# Altium schematic sheet ESP32 Schematic Sheet.SchDoc (part 1 of 3)
size A2; SheetNumber: 1; SheetTotal: 1
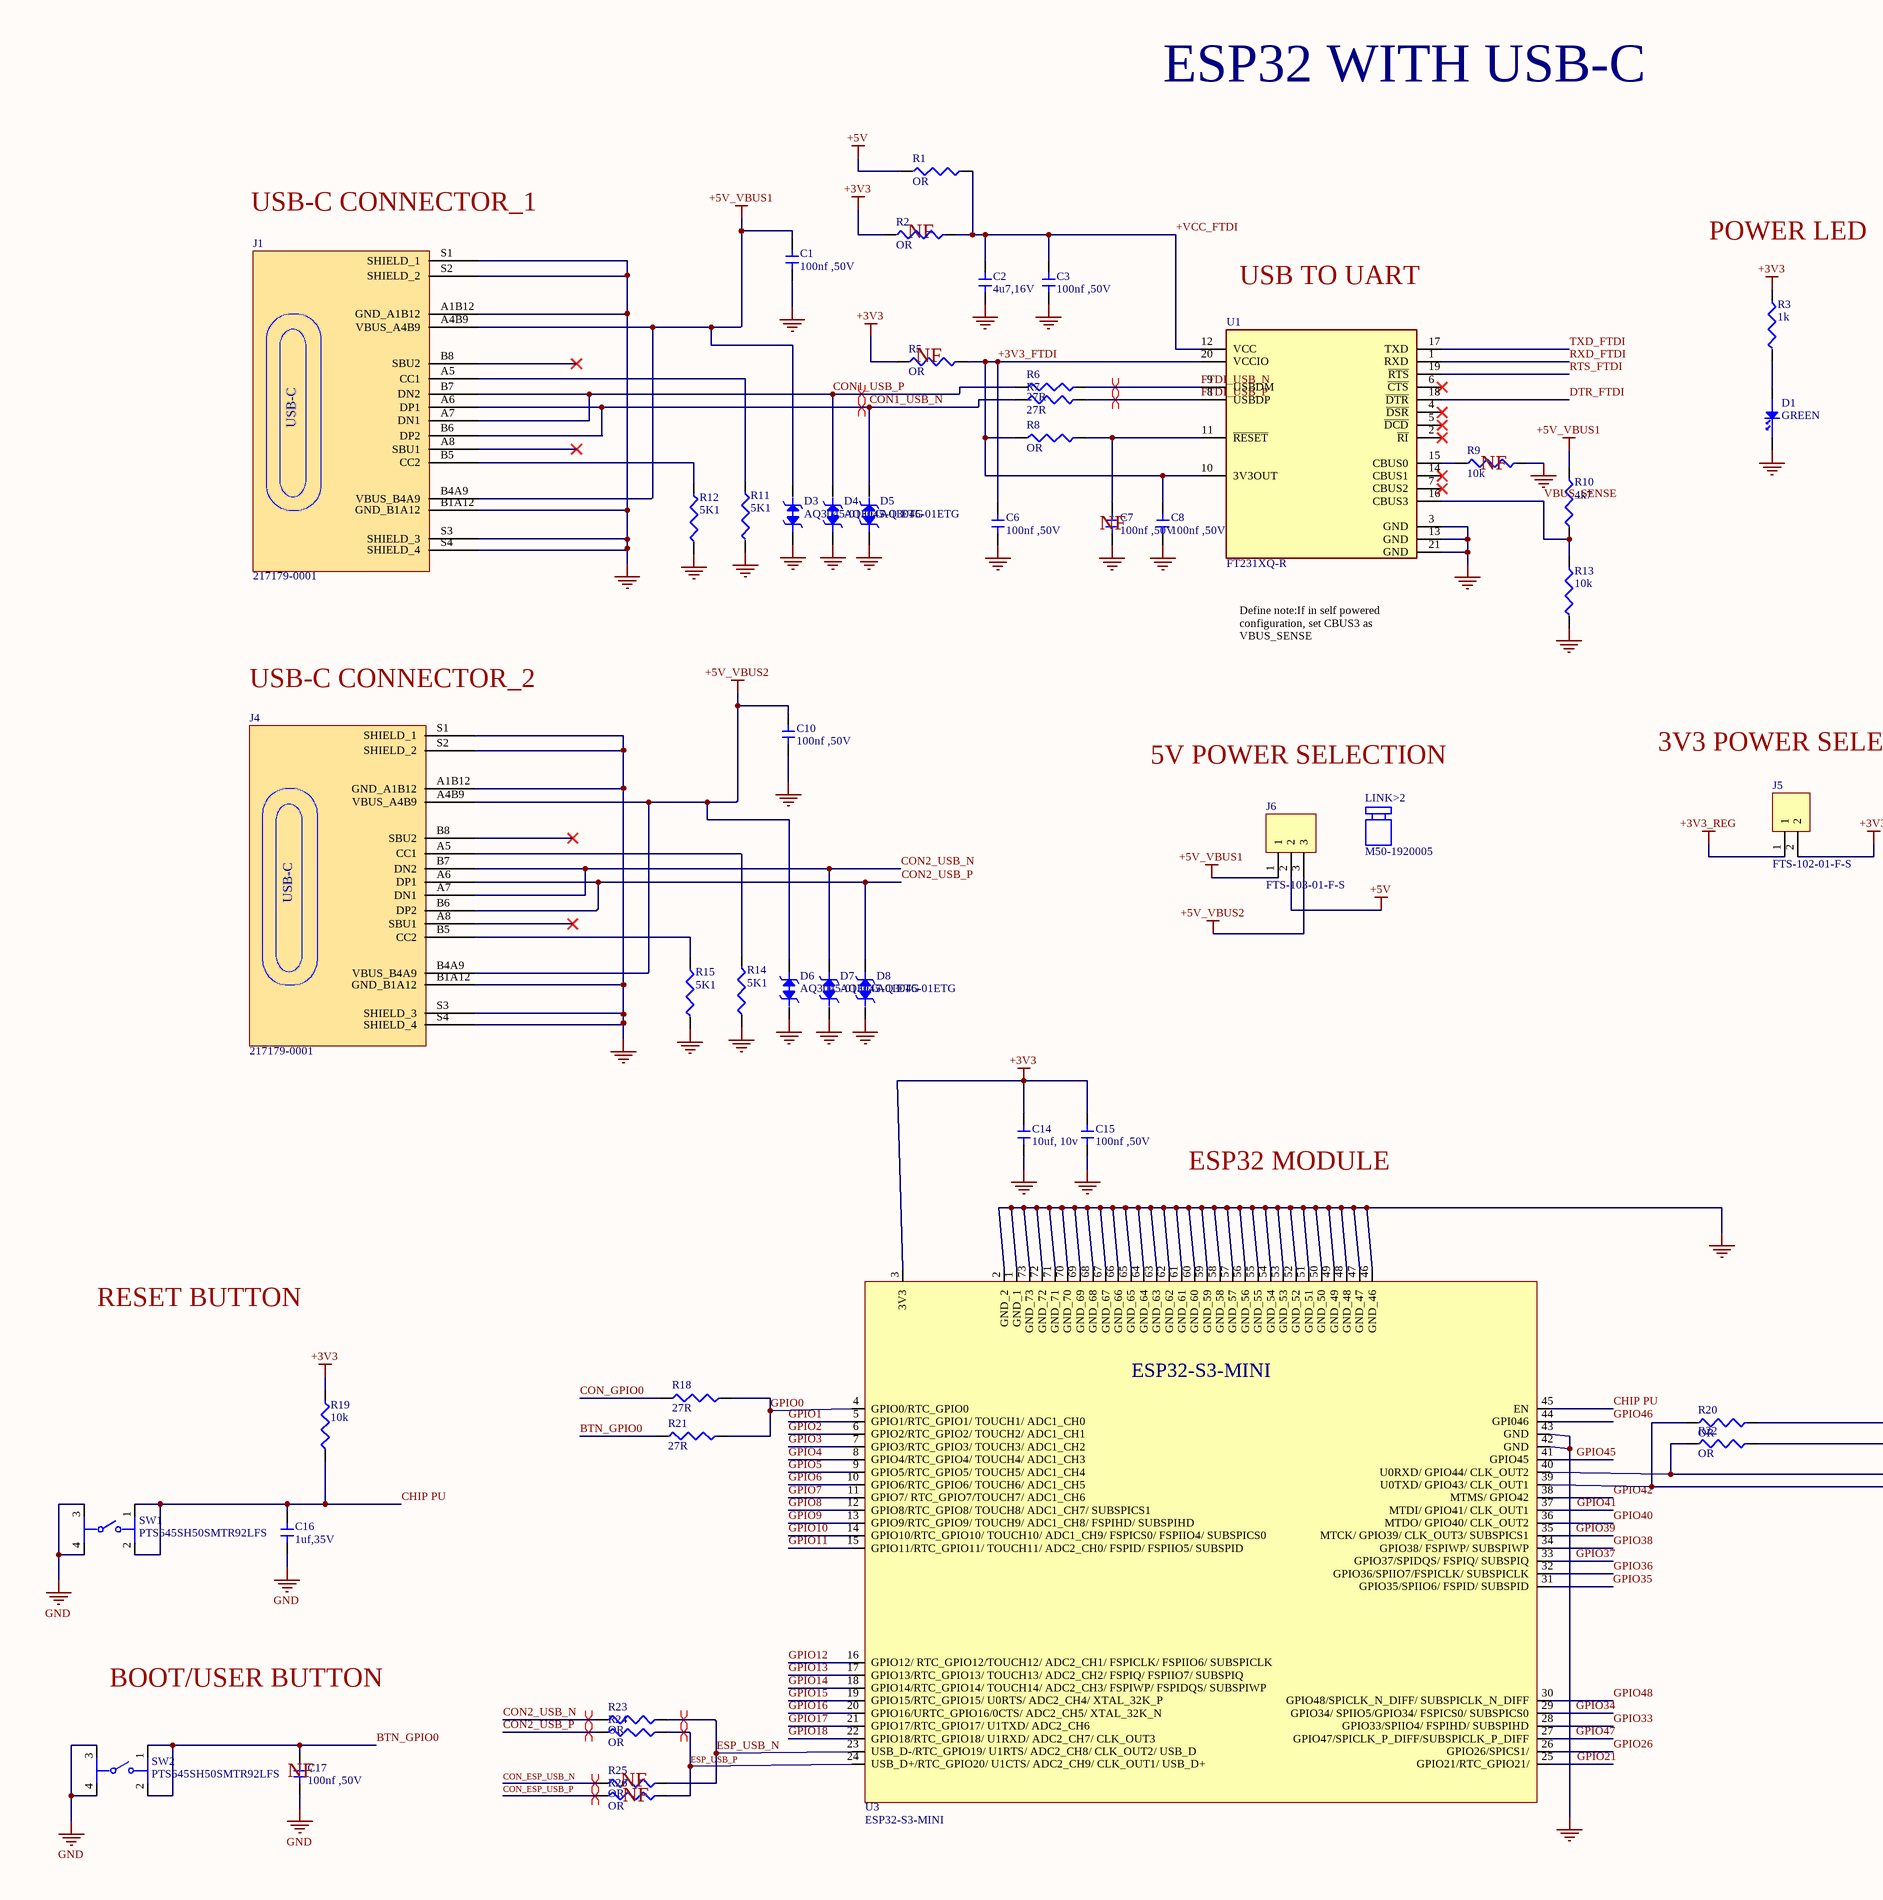
[diagram p0: ESP32 Schematic Sheet.SchDoc, left]
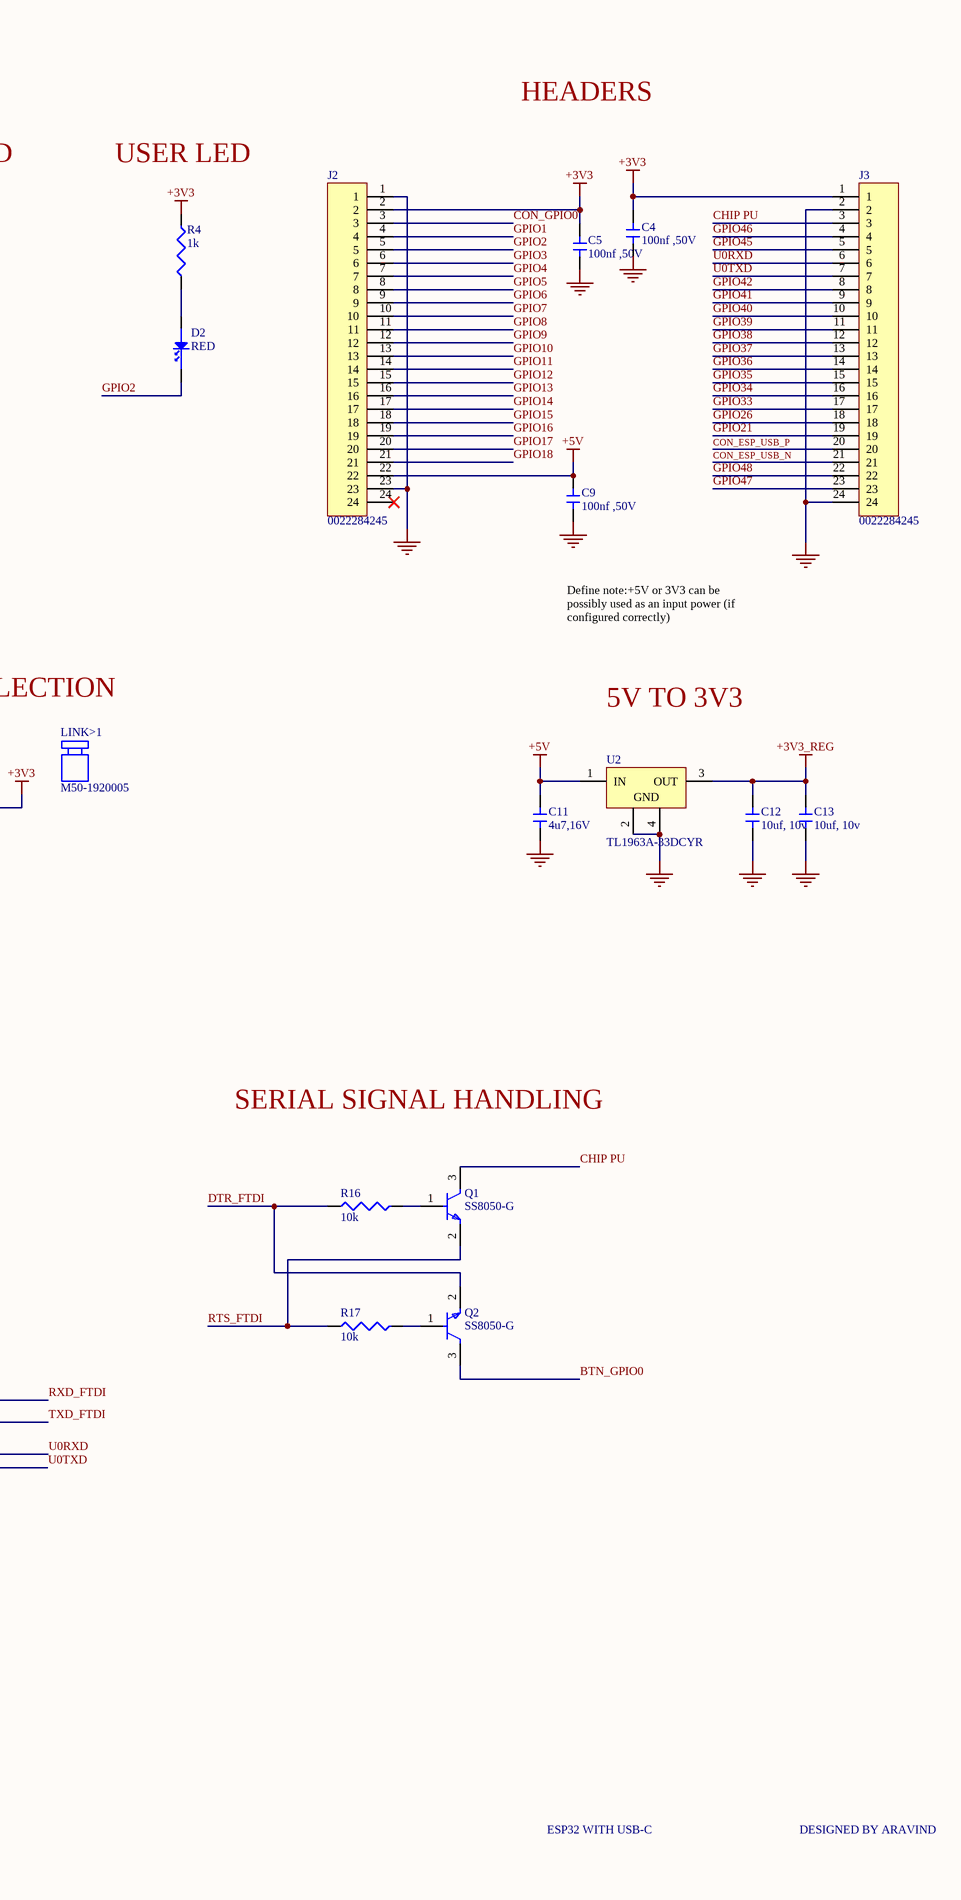
[diagram p1: ESP32 Schematic Sheet.SchDoc, right]

## Parts
C1  100nf ,50V  [CAPC1005X55N]
C2  4u7,16V  [CAPC1005X55N]
C3  100nf ,50V  [CAPC1005X55N]
C4  100nf ,50V  [CAPC1005X55N]
C5  100nf ,50V  [CAPC1005X55N]
C6  100nf ,50V  [CAPC1005X55N]
C7  100nf ,50V  [CAPC1005X55N]
C8  100nf ,50V  [CAPC1005X55N]
C9  100nf ,50V  [CAPC1005X55N]
C10  100nf ,50V  [CAPC1005X55N]
C11  4u7,16V  [CAPC1005X55N]
C12  10uf, 10v  [CAPC1005X55N]
C13  10uf, 10v  [CAPC1005X55N]
C14  10uf, 10v  [CAPC1005X55N]
C15  100nf ,50V  [CAPC1005X55N]
C16  1uf,35V  [CAPC1005X55N]
C17  100nf ,50V  [CAPC1005X55N]
D1  GREEN  [LED0402G]
D2  RED  [LED0402R]
D3  AQ3045-01ETG  [SOD882]
D4  AQ3045-01ETG  [SOD882]
D5  AQ3045-01ETG  [SOD882]
D6  AQ3045-01ETG  [SOD882]
D7  AQ3045-01ETG  [SOD882]
D8  AQ3045-01ETG  [SOD882]
J1  217179-0001  [FP-2171790001-MFG]
J2  0022284245  [HDR_1X24_2.54MM]
J3  0022284245  [HDR_1X24_2.54MM]
J4  217179-0001  [FP-2171790001-MFG]
J5  FTS-102-01-F-S  [HDR_1X2_1.27MM]
J6  FTS-103-01-F-S  [HDR_1X3_1.27MM]
LINK>1  M50-1920005
LINK>2  M50-1920005
Q1  SS8050-G  [FP-SS8050-G-IPC_B]
Q2  SS8050-G  [FP-SS8050-G-IPC_B]
R1  OR  [RESC1005X37N]
R2  OR  [RESC1005X37N]
R3  1k  [RESC1005X37N]
R4  1k  [RESC1005X37N]
R5  OR  [RESC1005X37N]
R6  27R  [RESC1005X37N]
R7  27R  [RESC1005X37N]
R8  OR  [RESC1005X37N]
R9  10k  [RESC1005X37N]
R10  4k7  [RESC1005X37N]
R11  5K1  [RESC1005X37N]
R12  5K1  [RESC1005X37N]
R13  10k  [RESC1005X37N]
R14  5K1  [RESC1005X37N]
R15  5K1  [RESC1005X37N]
R16  10k  [RESC1005X37N]
R17  10k  [RESC1005X37N]
R18  27R  [RESC1005X37N]
R19  10k  [RESC1005X37N]
R20  OR  [RESC1005X37N]
R21  27R  [RESC1005X37N]
R22  OR  [RESC1005X37N]
R23  OR  [RESC1005X37N]
R24  OR  [RESC1005X37N]
R25  OR  [RESC1005X37N]
R26  OR  [RESC1005X37N]
SW1  PTS645SH50SMTR92LFS  [FP-PTS645SH50SMTR92LFS-MFG]
SW2  PTS645SH50SMTR92LFS  [FP-PTS645SH50SMTR92LFS-MFG]
U1  FT231XQ-R  [FP-QFN-20-IPC_B]
U2  TL1963A-33DCYR  [DCY0004A_N]
U3  ESP32-S3-MINI  [XCVR_ESP32-S3-MINI-1-N8]

## Nets
+3V3: C4.2 C5.2 C14.2 C15.2 J2.2 J3.1 J5.2 R2.1 R3.2 R4.2 R5.1 R19.2 U3.3(3V3)
+3V3_REG: C12.2 C13.2 J5.1 U2.3(OUT)
+5V: C9.2 C11.1 J2.22 J6.2 R1.1 U2.1(IN)
+5V_VBUS1: C1.2 D3.2 J1.A4B9(VBUS_A4B9) J1.B4A9(VBUS_B4A9) J6.1 R10.2
+5V_VBUS2: C10.2 D6.2 J4.A4B9(VBUS_A4B9) J4.B4A9(VBUS_B4A9) J6.3
GND: C1.1 C2.2 C3.1 C4.1 C5.1 C6.1 C7.1 C8.1 C9.1 C10.1 C11.2 C12.1 C13.1 C14.1 C15.1 C16.1 C17.1 D1.1 D3.1 D4.1 D5.1 D6.1 D7.1 D8.1 J1.A1B12(GND_A1B12) J1.B1A12(GND_B1A12) J1.S1(SHIELD_1) J1.S2(SHIELD_2) J1.S3(SHIELD_3) J1.S4(SHIELD_4) J2.1 J2.23 J3.2 J3.24 J4.A1B12(GND_A1B12) J4.B1A12(GND_B1A12) J4.S1(SHIELD_1) J4.S2(SHIELD_2) J4.S3(SHIELD_3) J4.S4(SHIELD_4) R9.2 R11.1 R12.1 R13.1 R14.1 R15.1 SW1.3 SW1.4 SW2.3 SW2.4 U1.3(GND) U1.13(GND) U1.21(GND) U2.2(GND) U2.4(GND) U3.1(GND_1) U3.2(GND_2) U3.42(GND) U3.43(GND) U3.46(GND_46) U3.47(GND_47) U3.48(GND_48) U3.49(GND_49) U3.50(GND_50) U3.51(GND_51) U3.52(GND_52) U3.53(GND_53) U3.54(GND_54) U3.55(GND_55) U3.56(GND_56) U3.57(GND_57) U3.58(GND_58) U3.59(GND_59) U3.60(GND_60) U3.61(GND_61) U3.62(GND_62) U3.63(GND_63) U3.64(GND_64) U3.65(GND_65) U3.66(GND_66) U3.67(GND_67) U3.68(GND_68) U3.69(GND_69) U3.70(GND_70) U3.71(GND_71) U3.72(GND_72) U3.73(GND_73)
+3V3_FTDI: C6.2 C8.2 R5.2 R8.1 U1.10(3V3OUT) U1.20(VCCIO)
+VCC_FTDI: C2.1 C3.2 R1.2 R2.2 U1.12(VCC)
BTN_GPIO0: C17.2 Q2.3(C) R21.1 SW2.1 SW2.2
CHIP PU: C16.2 J3.3 Q1.3(C) R19.1 SW1.1 SW1.2 U3.45(EN)
CON1_USB_N: D5.2 J1.A6(DP1) J1.B6(DP2) R7.1
CON1_USB_P: D4.2 J1.A7(DN1) J1.B7(DN2) R6.1
CON2_USB_N: D7.2 J4.A7(DN1) J4.B7(DN2) R23.1
CON2_USB_P: D8.2 J4.A6(DP1) J4.B6(DP2) R24.1
CON_ESP_USB_N: J3.21 R25.1
CON_ESP_USB_P: J3.20 R26.1
CON_GPIO0: J2.3 R18.1
DTR_FTDI: Q2.2(E) R16.1 U1.18(~{DTR})
ESP_USB_N: R23.2 R25.2 U3.23(USB_D-/RTC_GPIO19/_U1RTS/_ADC2_CH8/_CLK_OUT2/_USB_D)
ESP_USB_P: R24.2 R26.2 U3.24(USB_D+/RTC_GPIO20/_U1CTS/_ADC2_CH9/_CLK_OUT1/_USB_D+)
FTDI_USB_N: R6.2 U1.9(USBDM)
FTDI_USB_P: R7.2 U1.8(USBDP)
GPIO0: R18.2 R21.2 U3.4(GPIO0/RTC_GPIO0)
GPIO1: J2.4 U3.5(GPIO1/RTC_GPIO1/_TOUCH1/_ADC1_CH0)
GPIO2: D2.1 J2.5 U3.6(GPIO2/RTC_GPIO2/_TOUCH2/_ADC1_CH1)
GPIO3: J2.6 U3.7(GPIO3/RTC_GPIO3/_TOUCH3/_ADC1_CH2)
GPIO4: J2.7 U3.8(GPIO4/RTC_GPIO4/_TOUCH4/_ADC1_CH3)
GPIO5: J2.8 U3.9(GPIO5/RTC_GPIO5/_TOUCH5/_ADC1_CH4)
GPIO6: J2.9 U3.10(GPIO6/RTC_GPIO6/_TOUCH6/_ADC1_CH5)
GPIO7: J2.10 U3.11(GPIO7/_RTC_GPIO7/TOUCH7/_ADC1_CH6)
GPIO8: J2.11 U3.12(GPIO8/RTC_GPIO8/_TOUCH8/_ADC1_CH7/_SUBSPICS1)
GPIO9: J2.12 U3.13(GPIO9/RTC_GPIO9/_TOUCH9/_ADC1_CH8/_FSPIHD/_SUBSPIHD)
GPIO10: J2.13 U3.14(GPIO10/RTC_GPIO10/_TOUCH10/_ADC1_CH9/_FSPICS0/_FSPIIO4/_SUBSPICS0)
GPIO11: J2.14 U3.15(GPIO11/RTC_GPIO11/_TOUCH11/_ADC2_CH0/_FSPID/_FSPIIO5/_SUBSPID)
GPIO12: J2.15 U3.16(GPIO12/_RTC_GPIO12/TOUCH12/_ADC2_CH1/_FSPICLK/_FSPIIO6/_SUBSPICLK)
GPIO13: J2.16 U3.17(GPIO13/RTC_GPIO13/_TOUCH13/_ADC2_CH2/_FSPIQ/_FSPIIO7/_SUBSPIQ)
GPIO14: J2.17 U3.18(GPIO14/RTC_GPIO14/_TOUCH14/_ADC2_CH3/_FSPIWP/_FSPIDQS/_SUBSPIWP)
GPIO15: J2.18 U3.19(GPIO15/RTC_GPIO15/_U0RTS/_ADC2_CH4/_XTAL_32K_P)
GPIO16: J2.19 U3.20(GPIO16/URTC_GPIO16/0CTS/_ADC2_CH5/_XTAL_32K_N)
GPIO17: J2.20 U3.21(GPIO17/RTC_GPIO17/_U1TXD/_ADC2_CH6)
GPIO18: J2.21 U3.22(GPIO18/RTC_GPIO18/_U1RXD/_ADC2_CH7/_CLK_OUT3)
GPIO21: J3.19 U3.25(GPIO21/RTC_GPIO21/)
GPIO26: J3.18 U3.26(GPIO26/SPICS1/)
GPIO33: J3.17 U3.28(GPIO33/SPIIO4/_FSPIHD/_SUBSPIHD)
GPIO34: J3.16 U3.29(GPIO34/_SPIIO5/GPIO34/_FSPICS0/_SUBSPICS0)
GPIO35: J3.15 U3.31(GPIO35/SPIIO6/_FSPID/_SUBSPID)
GPIO36: J3.14 U3.32(GPIO36/SPIIO7/FSPICLK/_SUBSPICLK)
GPIO37: J3.13 U3.33(GPIO37/SPIDQS/_FSPIQ/_SUBSPIQ)
GPIO38: J3.12 U3.34(GPIO38/_FSPIWP/_SUBSPIWP)
GPIO39: J3.11 U3.35(MTCK/_GPIO39/_CLK_OUT3/_SUBSPICS1)
GPIO40: J3.10 U3.36(MTDO/_GPIO40/_CLK_OUT2)
GPIO41: J3.9 U3.37(MTDI/_GPIO41/_CLK_OUT1)
GPIO42: J3.8 U3.38(MTMS/_GPIO42)
GPIO45: J3.5 U3.41(GPIO45)
GPIO46: J3.4 U3.44(GPI046)
GPIO47: J3.23 U3.27(GPIO47/SPICLK_P_DIFF/SUBSPICLK_P_DIFF)
GPIO48: J3.22 U3.30(GPIO48/SPICLK_N_DIFF/_SUBSPICLK_N_DIFF)
RTS_FTDI: Q1.2(E) R17.1 U1.19(~{RTS})
RXD_FTDI: R20.2 U1.1(RXD)
TXD_FTDI: R22.2 U1.17(TXD)
U0RXD: J3.6 R22.1 U3.40(U0RXD/_GPIO44/_CLK_OUT2)
U0TXD: J3.7 R20.1 U3.39(U0TXD/_GPIO43/_CLK_OUT1)
VBUS_SENSE: R10.1 R13.2 U1.16(CBUS3)
NetC7_2: C7.2 R8.2 U1.11(~{RESET})
NetD1_2: D1.2 R3.1
NetD2_2: D2.2 R4.1
NetJ1_A5: J1.A5(CC1) R11.2
NetJ1_B5: J1.B5(CC2) R12.2
NetJ4_A5: J4.A5(CC1) R14.2
NetJ4_B5: J4.B5(CC2) R15.2
NetQ1_1: Q1.1(B) R16.2
NetQ2_1: Q2.1(B) R17.2
NetR9_1: R9.1 U1.15(CBUS0)

Not connected (* = marked no-connect by the designer): J1 A8(SBU1)* B8(SBU2)*; J2 24*; J4 A8(SBU1)* B8(SBU2)*; U1 2(~{RI})* 4(~{DSR})* 5(~{DCD})* 6(~{CTS})* 7(CBUS2)* 14(CBUS1)*

## Layout directives
differential pair; differential pair class DIFF90: CON1_USB_N, CON1_USB_P, CON2_USB_N, CON2_USB_P, CON_ESP_USB_N, CON_ESP_USB_P, ESP_USB_N, ESP_USB_P, FTDI_USB_N, FTDI_USB_P

## Notes on the sheet
- ESP32 WITH USB-C
- HEADERS
- (near J1) USB-C CONNECTOR_1
- (near R2) NF
- POWER LED
- USER LED
- USB TO UART
- (near R5) NF
- (near R9) NF
- (near C7) NF
- Define note:If in self powered configuration, set CBUS3 as VBUS_SENSE
- (near J4) USB-C CONNECTOR_2
- Define note:+5V or 3V3 can be possibly used as an input power (if configured correctly)
- (near LINK>2) 5V POWER SELECTION
- (near LINK>1) 3V3 POWER SELECTION
- 5V TO 3V3
- SERIAL SIGNAL HANDLING
- ESP32 MODULE
- RESET BUTTON
- BOOT/USER BUTTON
- (near C17) NF
- NF
- DESIGNED BY ARAVIND
- (in symbol 217179-0001) USB-C